# Altium schematic sheet CutMonitor_Power.SchDoc: Аудиопередатчик
size 420 x 297 mm; ApprovedBy: Чукалкин; CheckedBy: Суворов; DrawnBy: Подлесный; DocumentNumber: ФНКЦ.542321.001 Э3; SheetNumber: 1; SheetTotal: 5; DocumentType: Схема электрическая принципиальная; Format: A3; ImagePath: ФНКЦ.542321.001
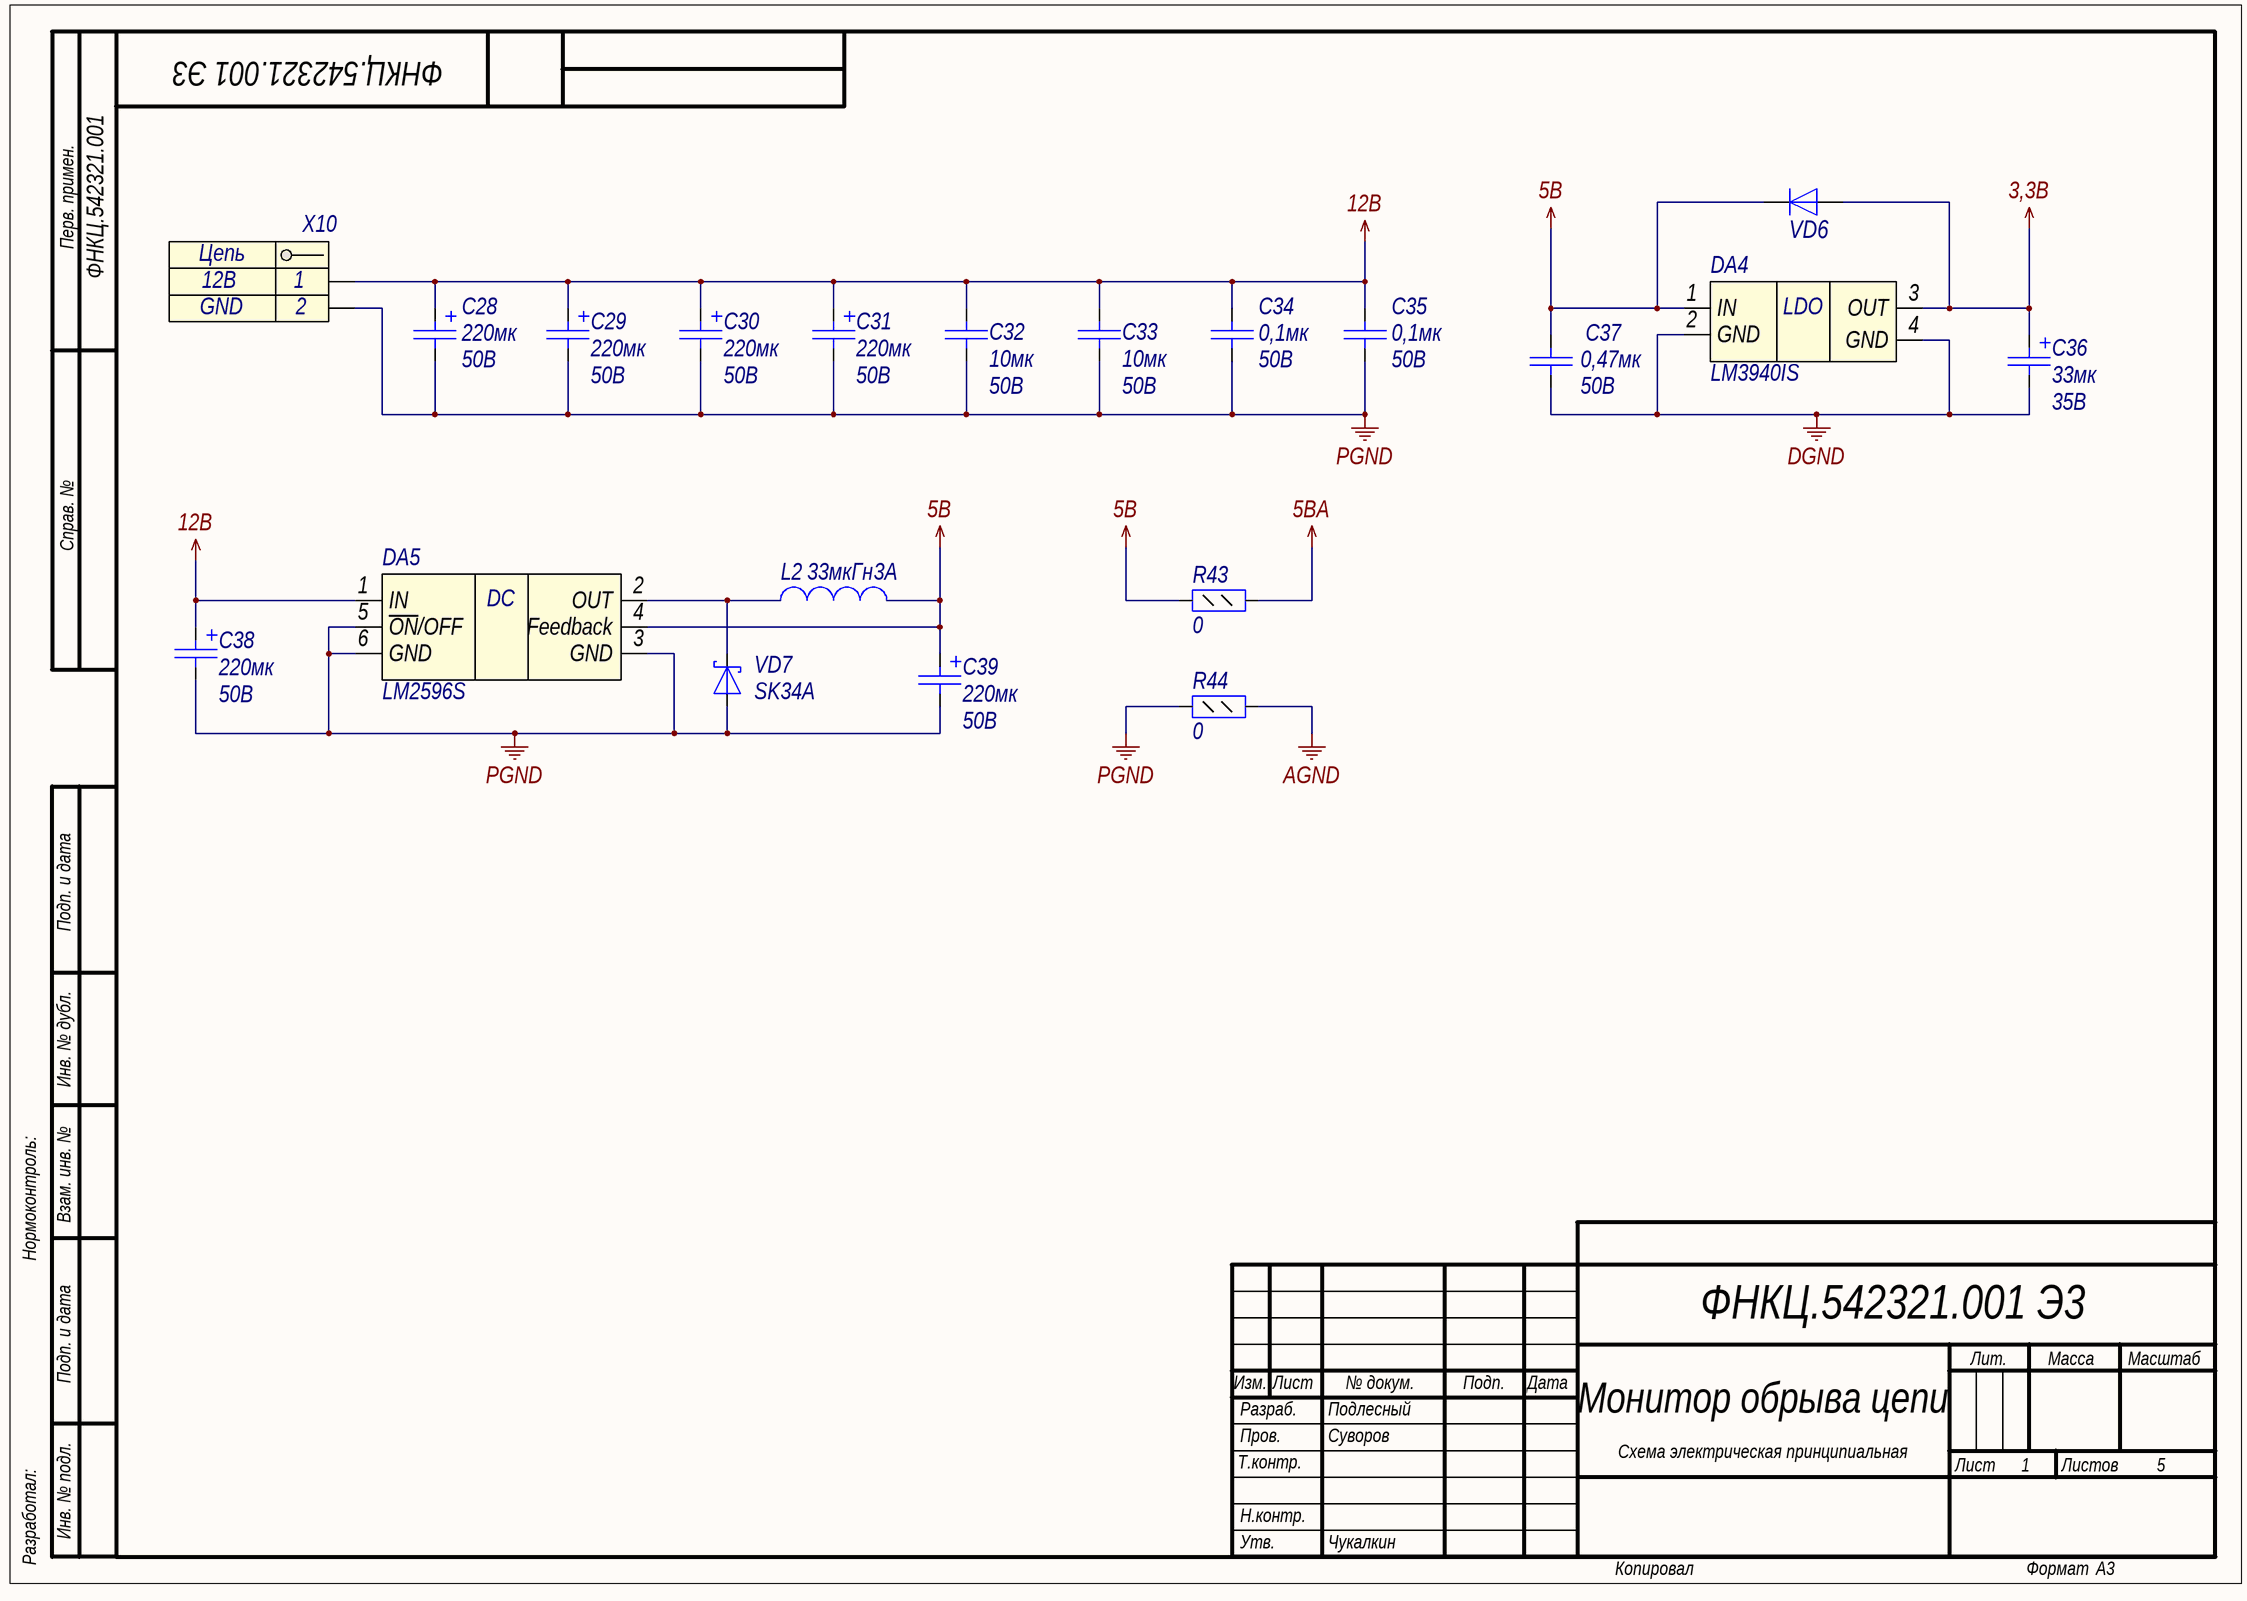
[diagram p0: CutMonitor_Power.SchDoc]

## Parts
C28  value 220мк  Voltage: 50В  [K50-35(10X12.5)]  (hidden comment: Capacitor_pol)
C29  value 220мк  Voltage: 50В  [K50-35(10X12.5)]  (hidden comment: Capacitor_pol)
C30  value 220мк  Voltage: 50В  [K50-35(10X12.5)_MIRROR]  (hidden comment: Capacitor_pol)
C31  value 220мк  Voltage: 50В  [K50-35(10X12.5)_MIRROR]  (hidden comment: Capacitor_pol)
C32  value 10мк  Voltage: 50В  [C1210]  (hidden comment: Capacitor)
C33  value 10мк  Voltage: 50В  [C1210]  (hidden comment: Capacitor)
C34  value 0,1мк  Voltage: 50В  [C1206]  (hidden comment: Capacitor)
C35  value 0,1мк  Voltage: 50В  [C1206]  (hidden comment: Capacitor)
C36  value 33мк  Voltage: 35В  [TANTAL CASE D]  (hidden comment: Capacitor_pol)
C37  value 0,47мк  Voltage: 50В  [C1206]  (hidden comment: Capacitor)
C38  value 220мк  Voltage: 50В  [K50-35(10X12.5)_MIRROR]  (hidden comment: Capacitor_pol)
C39  value 220мк  Voltage: 50В  [K50-35(10X12.5)_MIRROR]  (hidden comment: Capacitor_pol)
DA4  LM3940IS  [TO-263-3]
DA5  LM2596S  [TO-263-5]
L2  value 33мкГн  Rated Current: 3A  [IND_12.8x12.8]  (hidden comment: Inductor)
R43  value 0  [R0805]  (hidden comment: Resistor_0,125Вт)
R44  value 0  [R0805]  (hidden comment: Resistor_0,125Вт)
VD6  Diode  [SOD-523]  (value not drawn)
VD7  Part Number: SK34A  [SMA]  (hidden comment: DiodeSchottky)
X10  Header_2_trm  [TERMINAL-2WAY-5MM]  (value not drawn)

## Nets
3,3B: C36.1 DA4.3(OUT) VD6.2(A)
5B: C37.2 C39.1 DA4.1(IN) DA5.4(Feedback) L2.2 R43.1 VD6.1(K)
5BA: R43.2
12B: C28.1 C29.1 C30.1 C31.1 C32.1 C33.1 C34.1 C35.1 C38.1 DA5.1(IN) X10.1
AGND: R44.2
DGND: C36.2 C37.1 DA4.2(GND) DA4.4(GND)
PGND: C28.2 C29.2 C30.2 C31.2 C32.2 C33.2 C34.2 C35.2 C38.2 C39.2 DA5.3(GND) DA5.5(~{ON}/OFF) DA5.6(GND) R44.1 VD7.2(A) X10.2
NetDA5_2: DA5.2(OUT) L2.1 VD7.1(K)

## Notes on the sheet
- Перв. примен.
- Справ. №
- Подп. и дата
- Инв. № дубл.
- Нормоконтроль:
- Взам. инв. №
- Изм.
- Лист
- № докум.
- Подп.
- Дата
- Лит.
- Масса
- Масштаб
- Т.контр.
- Пров.
- Разраб.
- Монитор обрыва цепи
- Листов
- Разработал:
- Инв. № подл.
- Н.контр.
- Утв.
- Копировал
- Формат
- (in symbol connect21) Цепь
- (in symbol pwr0) LDO
- (in symbol pwr3) DC

## Library data of the parts
C28 C29 = cap219: Конденсатор полярный; Part Name: Electrolit; Manufacture: Jamicon; Part Number: TKR221M1HG13; id: cap219; tga: 0.20%
C30 C31 C38 C39 = cap220: Конденсатор полярный; Part Name: Electrolit; Manufacture: Jamicon; Part Number: TKR221M1HG13; id: cap220; tga: 0.20%
C32 C33 = cap206: Конденсатор; Part Name: Ceramic; Manufacture: Murata; Part Number: GRM32ER71H106K; id: cap206; TKE: X7R
C34 C35 = cap180: Конденсатор; Part Name: Ceramic; Manufacture: Murata; Part Number: GRM319R71H104K**; id: cap180; TKE: X7R
C36 = cap260: Конденсатор полярный; Part Name: Tantal; Manufacture: AVX; Part Number: TAJD336K035RNJ; id: cap260
C37 = cap183: Конденсатор; Part Name: Ceramic; Manufacture: Murata; Part Number: GRM31MR71H474K; id: cap183; TKE: X7R
DA4 = pwr0: Low-Dropout Regulator for 5-V to 3.3-V Conversion; Part Name: Regulator for 5V to 3.3V Conversion; Part Number: LM3940IS-3.3/NOPB; Manufacturer: Texas Instruments; id: pwr0; Input Voltage: 5B; Output Voltage: 3,3B; Dropout Voltage: 200mV,1V; Current: 1A; Type: Linear
DA5 = pwr3: 3-A Step-Down Voltage Regulator; Part Name: 3A Step-Down Voltage Regulator; Part Number: LM2596S-5.0/NOPB; Manufacturer: Texas Instruments; id: pwr3; Input Voltage: 40B; Output Voltage: 5B; Current: 3A; Type: Impulse
L2 = ind80: EMI Suppression Filter; Part Name: SMD Power Inductors; Part Number: B82477G4333M000; Manufacture: Epcos; id: ind80; Saturation Current: 3,5A; Resistance: 0,053Ohm
R43 R44 = res0: Резистор; Manufacture: Yageo; Part Number: RC0805FR-070RL; id: res0; Accuracy: 0,01; Part Name: Resistor; Power: 0,125Вт
VD6 = diode3: Диод; Part Number: BAS516.135; Manufacture: Nexperia; id: diode3; Max Reverse Voltage: 100B; Forward Voltage: 1B; Leakage current: 0,5uA; Reverse Recovery time: 4ns; Capacitance: 1,5pF; Part Name: Diode
VD7 = diode1: Диод Шоттки; Manufacture: Taiwan Semiconductor; id: diode1; Max Reverse Voltage: 40B; Forward Voltage: 0,55B; Forward Current: 3A; Part Name: Diode Schottky
X10 = connect21: Разъем - 2 конт. клеммник; Part Name: TERMINAL BLOCK 2 way; Contact_1: 12B; Contact_2: GND; Etch: 5mm; id: connect21